# EAGLE design Shruthi-Analog-LP2Delay-v02 (EAGLE 5.09)
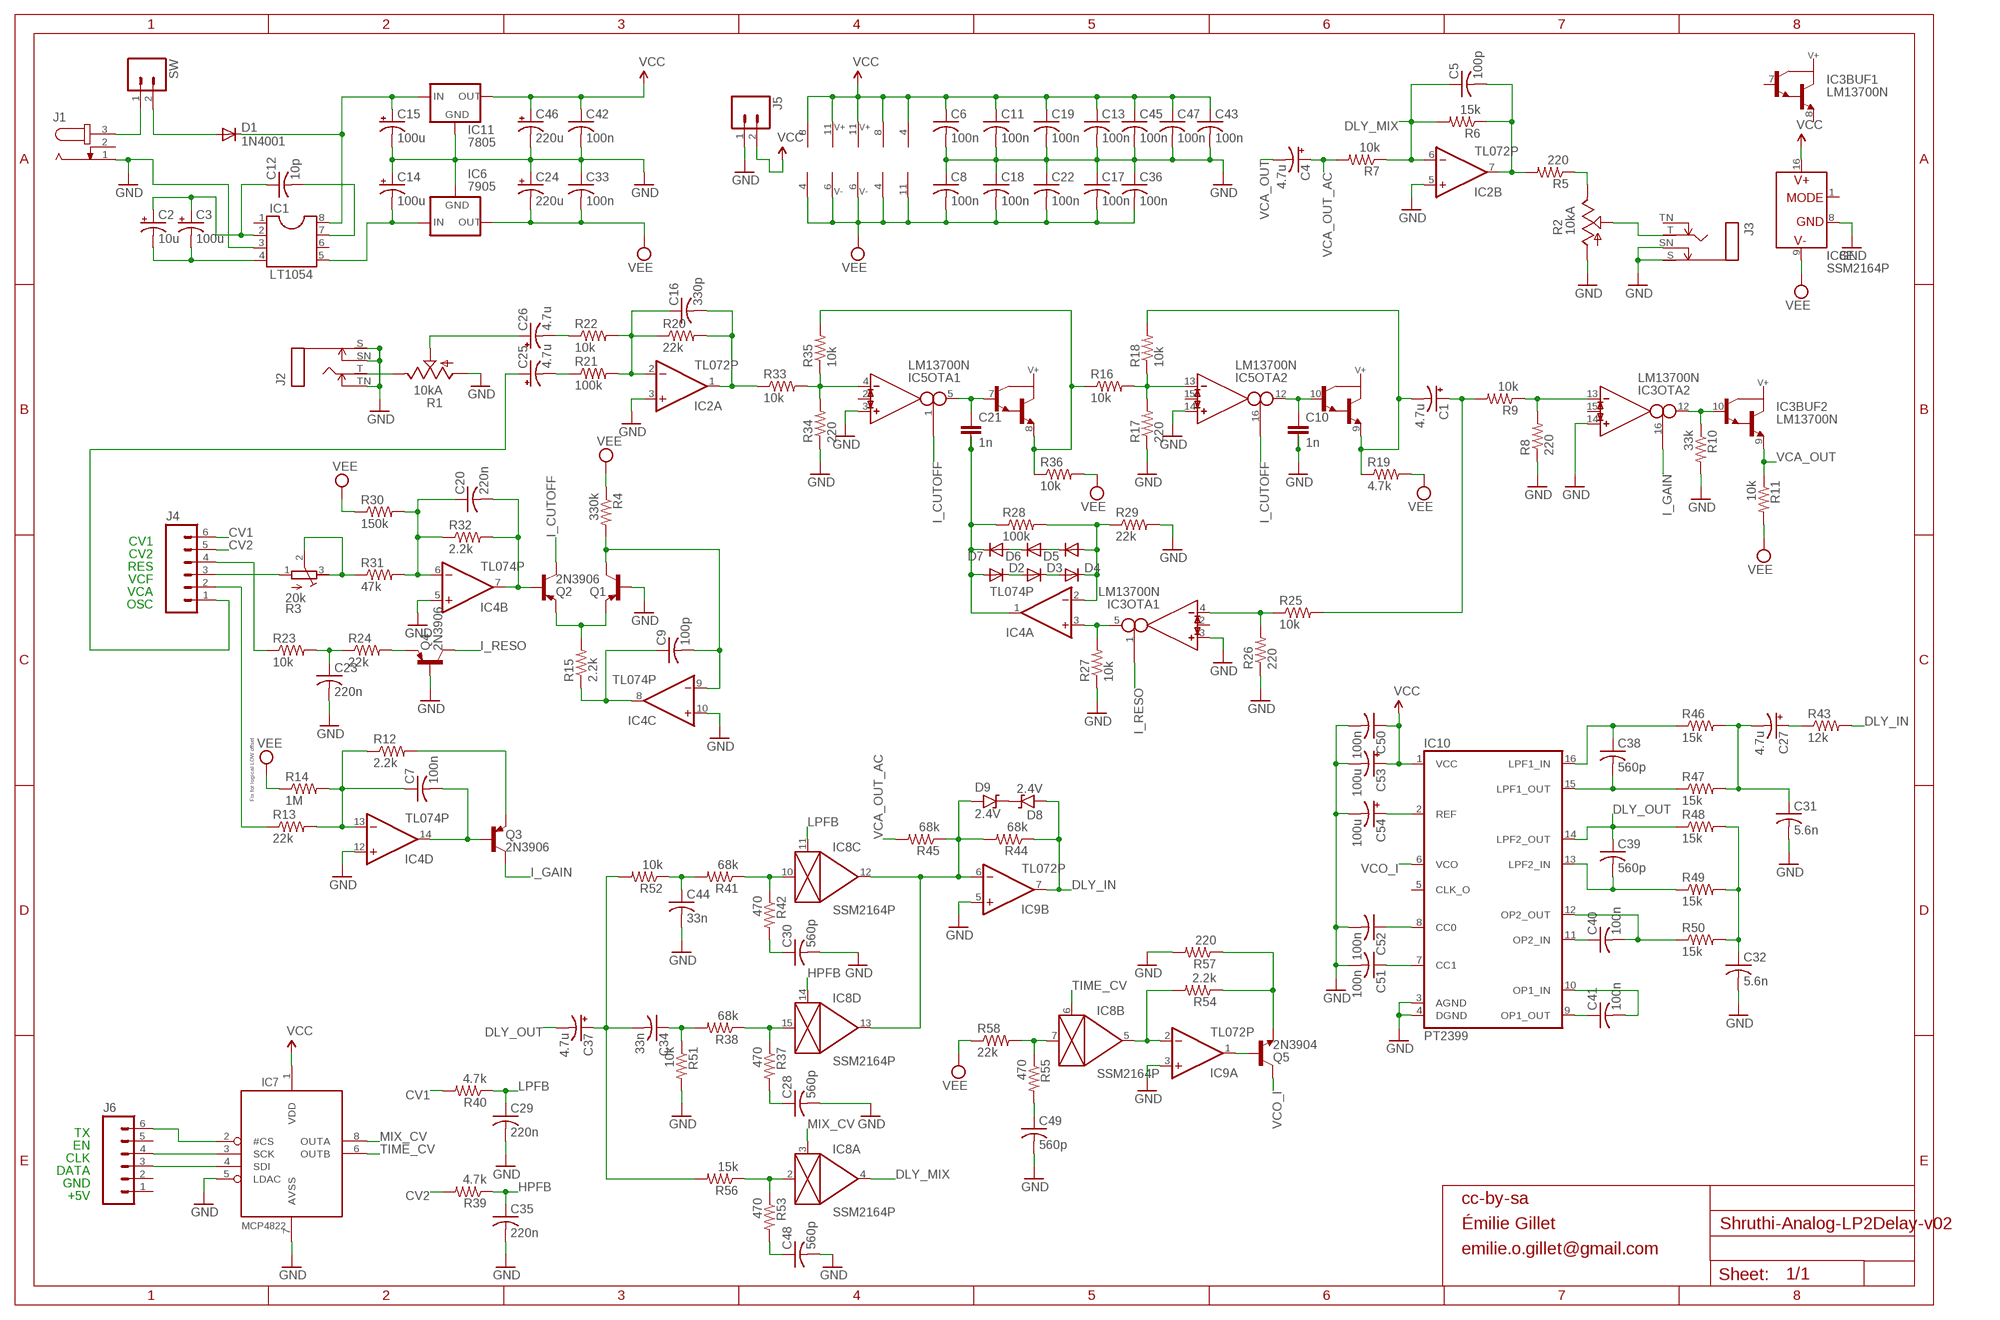
[diagram p0: schematic, sheet 1]

## Parts
C1  4.7u  CPOL-USE2.5-6  [E2,5-6]
C2  10u  CPOL-USE2.5-5  [E2,5-5]
C3  100u  CPOL-USE2.5-6  [E2,5-6]
C4  4.7u  CPOL-USE2.5-6  [E2,5-6]
C5  100p  C-US025-025X050  [C025-025X050]
C6  100n  C-US025-025X050  [C025-025X050]
C7  100n  C-US025-025X050  [C025-025X050]
C8  100n  C-US025-025X050  [C025-025X050]
C9  100p  C-US025-025X050  [C025-025X050]
C10  1n  C-2.5-5/2  [C2.5/5-2]
C11  100n  C-US025-025X050  [C025-025X050]
C12  10p  C-US025-025X050  [C025-025X050]
C13  100n  C-US025-025X050  [C025-025X050]
C14  100u  CPOL-USE2.5-7  [E2,5-7]
C15  100u  CPOL-USE2.5-7  [E2,5-7]
C16  330p  C-US025-025X050  [C025-025X050]
C17  100n  C-US025-025X050  [C025-025X050]
C18  100n  C-US025-025X050  [C025-025X050]
C19  100n  C-US025-025X050  [C025-025X050]
C20  220n  C-US025-025X050  [C025-025X050]
C21  1n  C-2.5-5/2  [C2.5/5-2]
C22  100n  C-US025-025X050  [C025-025X050]
C23  220n  C-US025-025X050  [C025-025X050]
C24  220u  CPOL-USE5-10.5  [E5-10,5]
C25  4.7u  CPOL-USE2.5-6  [E2,5-6]
C26  4.7u  CPOL-USE2.5-6  [E2,5-6]
C27  4.7u  CPOL-USE2.5-6  [E2,5-6]
C28  560p  C-US025-025X050  [C025-025X050]
C29  220n  C-US025-025X050  [C025-025X050]
C30  560p  C-US025-025X050  [C025-025X050]
C31  5.6n  C-US025-025X050  [C025-025X050]
C32  5.6n  C-US025-025X050  [C025-025X050]
C33  100n  C-US025-025X050  [C025-025X050]
C34  33n  C-US050-025X075  [C050-025X075]
C35  220n  C-US025-025X050  [C025-025X050]
C36  100n  C-US025-025X050  [C025-025X050]
C37  4.7u  CPOL-USE2.5-6  [E2,5-6]
C38  560p  C-US025-025X050  [C025-025X050]
C39  560p  C-US025-025X050  [C025-025X050]
C40  100n  C-US025-025X050  [C025-025X050]
C41  100n  C-US025-025X050  [C025-025X050]
C42  100n  C-US025-025X050  [C025-025X050]
C43  100n  C-US025-025X050  [C025-025X050]
C44  33n  C-US050-025X075  [C050-025X075]
C45  100n  C-US025-025X050  [C025-025X050]
C46  220u  CPOL-USE5-10.5  [E5-10,5]
C47  100n  C-US025-025X050  [C025-025X050]
C48  560p  C-US025-025X050  [C025-025X050]
C49  560p  C-US025-025X050  [C025-025X050]
C50  100n  C-US025-025X050  [C025-025X050]
C51  100n  C-US025-025X050  [C025-025X050]
C52  100n  C-US025-025X050  [C025-025X050]
C53  100u  CPOL-USE2.5-7  [E2,5-7]
C54  100u  CPOL-USE2.5-7  [E2,5-7]
D1  1N4001  1N4004  [DO41-10]
D2  DIODE-D-5  [D-5]
D3  DIODE-D-5  [D-5]
D4  DIODE-D-5  [D-5]
D5  DIODE-D-5  [D-5]
D6  DIODE-D-5  [D-5]
D7  DIODE-D-5  [D-5]
D8  2.4V  1N47XXDO35  [D-5]
D9  2.4V  1N47XXDO35  [D-5]
IC1  LT1054  DIL8  [DIL08]
IC2  TL072P  [DIL08]
IC3  LM13700N  [DIL16]
IC4  TL074P  TL084P  [DIL14]
IC5  LM13700N  [DIL16]
IC6  7905  79XXS  [79XXS]
IC7  MCP4822  [DIL08]
IC8  SSM2164P  [DIL16]
IC9  TL072P  [DIL08]
IC10  PT2399  [DIL16]
IC11  7805  78XXS  [78XXS]
J1  JACK-PLUG2  [SPC4078_BIG_HOLES]
J2  MONOSWS  [NMJ4HC-S]
J3  MONOSWS  [NMJ4HC-S]
J4  M06SIP  [1X06]
J5  M02PTH  [1X02]
J6  M06SIP  [1X06]
Q1  2N3906  2N3906-  [TO92-]
Q2  2N3906  2N3906-  [TO92-]
Q3  2N3906  2N3906-  [TO92-]
Q4  2N3906  2N3906-  [TO92-]
Q5  2N3904  [TO92-]
R1  10kA  POT_USCABLED  [CABLE_POT_6MM]
R2  10kA  POT_USCABLED  [CABLE_POT_6MM]
R3  20k  R-TRIMM3296X  [RTRIM3296X]
R4  330k  R-US_0204/7  [0204/7]
R5  220  R-US_0204/7  [0204/7]
R6  15k  R-US_0204/7  [0204/7]
R7  10k  R-US_0204/7  [0204/7]
R8  220  R-US_0204/7  [0204/7]
R9  10k  R-US_0204/7  [0204/7]
R10  33k  R-US_0204/7  [0204/7]
R11  10k  R-US_0204/7  [0204/7]
R12  2.2k  R-US_0204/7  [0204/7]
R13  22k  R-US_0204/7  [0204/7]
R14  1M  R-US_0204/7  [0204/7]
R15  2.2k  R-US_0204/7  [0204/7]
R16  10k  R-US_0204/7  [0204/7]
R17  220  R-US_0204/7  [0204/7]
R18  10k  R-US_0204/7  [0204/7]
R19  4.7k  R-US_0204/7  [0204/7]
R20  22k  R-US_0204/7  [0204/7]
R21  100k  R-US_0204/7  [0204/7]
R22  10k  R-US_0204/7  [0204/7]
R23  10k  R-US_0204/7  [0204/7]
R24  22k  R-US_0204/7  [0204/7]
R25  10k  R-US_0204/7  [0204/7]
R26  220  R-US_0204/7  [0204/7]
R27  10k  R-US_0204/7  [0204/7]
R28  100k  R-US_0204/7  [0204/7]
R29  22k  R-US_0204/7  [0204/7]
R30  150k  R-US_0204/7  [0204/7]
R31  47k  R-US_0204/7  [0204/7]
R32  2.2k  R-US_0204/7  [0204/7]
R33  10k  R-US_0204/7  [0204/7]
R34  220  R-US_0204/7  [0204/7]
R35  10k  R-US_0204/7  [0204/7]
R36  10k  R-US_0204/7  [0204/7]
R37  470  R-US_0204/7  [0204/7]
R38  68k  R-US_0204/7  [0204/7]
R39  4.7k  R-US_0204/7  [0204/7]
R40  4.7k  R-US_0204/7  [0204/7]
R41  68k  R-US_0204/7  [0204/7]
R42  470  R-US_0204/7  [0204/7]
R43  12k  R-US_0204/7  [0204/7]
R44  68k  R-US_0204/7  [0204/7]
R45  68k  R-US_0204/7  [0204/7]
R46  15k  R-US_0204/7  [0204/7]
R47  15k  R-US_0204/7  [0204/7]
R48  15k  R-US_0204/7  [0204/7]
R49  15k  R-US_0204/7  [0204/7]
R50  15k  R-US_0204/7  [0204/7]
R51  10k  R-US_0204/7  [0204/7]
R52  10k  R-US_0204/7  [0204/7]
R53  470  R-US_0204/7  [0204/7]
R54  2.2k  R-US_0204/7  [0204/7]
R55  470  R-US_0204/7  [0204/7]
R56  15k  R-US_0204/7  [0204/7]
R57  220  R-US_0204/7  [0204/7]
R58  22k  R-US_0204/7  [0204/7]
SW  M02PTH  [1X02]

## Nets
2P: C1.- IC5.9(BUF2:E) R18.2 R19.1
CAP_IN: D9.A IC8.12(C:OUT) IC8.13(D:OUT) IC9.6(B:-IN) R44.2 R45.1
CV1: J4.6 R40.2
CV2: J4.5 R39.2
DLY_IN: D8.A IC9.7(B:OUT) R43.2 R44.1
DLY_MIX: C5.1 IC2.6(B:-IN) IC8.4(A:OUT) R6.2 R7.1
DLY_OUT: C37.- C39.1 IC10.14(LPF2_OUT) R48.1
GND: C6.2 C8.1 C10.2 C10.3 C11.2 C13.2 C14.+ C15.- C17.1 C18.1 C19.2 C22.1 C23.2 C24.+ C28.2 C29.2 C30.2 C31.2 C32.2 C33.1 C35.2 C36.1 C42.2 C43.2 C44.2 C45.2 C46.- C47.2 C48.2 C49.2 C50.2 C51.2 C52.2 C53.- C54.- IC1.3 IC2.3(A:+IN) IC2.5(B:+IN) IC3.3(OTA1:IN_P) IC3.14(OTA2:IN_P) IC4.5(B:+IN) IC4.10(C:+IN) IC4.12(D:+IN) IC5.3(OTA1:IN_P) IC5.14(OTA2:IN_P) IC6.GND IC7.5(LDAC) IC7.7(AVSS) IC8.8(E:GND) IC9.3(A:+IN) IC9.5(B:+IN) IC10.3(AGND) IC10.4(DGND) IC11.GND J1.1 J2.S J2.SN J2.TN J3.S J3.SN J5.1 Q1.2(B) Q4.2(B) R1.A R2.A R8.1 R10.2 R17.1 R26.1 R27.1 R29.2 R34.1 R51.2 R57.2
HPFB: C35.1 IC8.14(D:CTRL) R39.1
I_CUTOFF: IC5.1(OTA1:I_BIAS) IC5.16(OTA2:I_BIAS) Q2.1(C)
I_GAIN: IC3.16(OTA2:I_BIAS) Q3.1(C)
I_RESO: IC3.1(OTA1:I_BIAS) Q4.1(C)
LPFB: C29.1 IC8.11(C:CTRL) R40.1
MIX: C16.2 IC2.1(A:OUT) R20.2 R33.1
MIX_CV: IC7.8(OUTA) IC8.3(A:CTRL)
N$1: IC3.5(OTA1:OUT) IC4.3(A:+IN) R27.2
N$2: C20.2 IC4.7(B:OUT) Q2.2(B) R32.2
N$3: R3.2(S) R3.3(A) R31.1
N$4: J4.3 R3.1(E)
N$5: C28.1 R37.2
N$6: C16.1 IC2.2(A:-IN) R20.1 R21.2 R22.2
N$7: Q1.3(E) Q2.3(E) R15.2
N$8: D4.C D5.A IC4.2(A:-IN) R28.2 R29.1
N$9: C9.1 IC4.8(C:OUT) R15.1
N$10: C9.2 IC4.9(C:-IN) Q1.1(C) R4.2
N$11: J4.4 R23.1
N$12: Q4.3(E) R24.2
N$13: J3.T R2.S
N$14: C23.1 R23.2 R24.1
N$16: IC5.13(OTA2:IN_N) R16.2 R17.2 R18.1
N$17: C30.1 R42.2
N$18: C1.+ R9.2 R25.2
N$19: IC5.8(BUF1:E) R16.1 R35.2 R36.1
N$20: C10.1 IC5.10(BUF2:B) IC5.12(OTA2:OUT)
N$21: IC8.10(C:IN) R41.1 R42.1
N$22: IC8.15(D:IN) R37.1 R38.1
N$23: IC5.4(OTA1:IN_N) R33.2 R34.2 R35.1
N$24: D5.C D6.A
N$25: R2.E R5.1
N$26: D6.C D7.A
N$27: C21.1 IC5.5(OTA1:OUT) IC5.7(BUF1:B)
N$28: D2.C D3.A
N$29: IC3.4(OTA1:IN_N) R25.1 R26.2
N$30: D3.C D4.A
N$31: C7.2 IC4.14(D:OUT) Q3.2(B)
N$32: C41.1 IC10.9(OP1_OUT)
N$33: IC3.10(BUF2:B) IC3.12(OTA2:OUT) R10.1
N$34: IC3.13(OTA2:IN_N) R8.2 R9.1
N$35: C25.+ J4.1
N$36: C51.1 IC10.7(CC1)
N$37: C52.1 IC10.8(CC0)
N$38: J2.T R1.E
N$39: C25.- R21.1
N$40: C20.1 IC4.6(B:-IN) R30.2 R31.2 R32.1
N$41: C27.+ R43.1
N$42: C54.+ IC10.2(REF)
N$43: C41.2 IC10.10(OP1_IN)
N$44: J1.3 SW.1
N$45: J4.2 R13.1
N$46: C15.+ D1.C IC1.8 IC11.IN
N$47: C2.+ C3.+ C12.1 IC1.2
N$48: C2.- C3.- IC1.4
N$49: C12.2 IC1.7
N$50: C40.1 IC10.11(OP2_IN)
N$51: C7.1 IC4.13(D:-IN) R12.1 R13.2 R14.2
N$55: C40.2 IC10.12(OP2_OUT) R50.1
N$56: D8.C D9.C
N$57: C38.2 IC10.15(LPF1_OUT) R47.1
N$58: C14.- IC1.5 IC6.IN
N$59: D1.A SW.2
N$60: C32.1 R48.2 R49.2 R50.2
N$61: C39.2 IC10.13(LPF2_IN) R49.1
N$62: C38.1 IC10.16(LPF1_IN) R46.1
N$63: C5.2 IC2.7(B:OUT) R5.2 R6.1
N$64: C27.- C31.1 R46.2 R47.2
N$65: C21.2 C21.3 D2.A D7.C IC4.1(A:OUT) R28.1
N$66: C26.+ R1.S
N$68: Q3.3(E) R12.2
N$70: IC9.1(A:OUT) Q5.2(B)
N$71: C48.1 R53.2
N$72: C26.- R22.1
N$73: IC8.2(A:IN) R53.1 R56.1
N$74: C34.1 R38.2 R51.1
N$75: C44.1 R41.2 R52.1
N$76: C34.2 C37.+ R52.2 R56.2
N$77: IC8.5(B:OUT) IC9.2(A:-IN) R54.2
N$78: Q5.3(E) R54.1 R57.1
N$80: IC7.2(#CS) J6.6
N$81: IC7.3(SCK) J6.4
N$82: IC7.4(SDI) J6.3
N$83: C49.1 R55.2
N$84: IC8.7(B:IN) R55.1 R58.2
TIME_CV: IC7.6(OUTB) IC8.6(B:CTRL)
VCA_OUT: C4.- IC3.9(BUF2:E) R11.1
VCA_OUT_AC: C4.+ R7.2 R45.2
VCC: C6.1 C11.1 C13.1 C19.1 C42.1 C43.1 C45.1 C46.+ C47.1 C50.1 C53.+ IC2.8(P:V+) IC3.11(SUPPLY:V+) IC4.4(P:V+) IC5.11(SUPPLY:V+) IC7.1(VDD) IC8.16(E:V+) IC9.8(P:V+) IC10.1(VCC) IC11.OUT J5.2
VCO_I: IC10.6(VCO) Q5.1(C)
VEE: C8.2 C17.2 C18.2 C22.2 C24.- C33.2 C36.2 IC2.4(P:V-) IC3.6(SUPPLY:V-) IC4.11(P:V-) IC5.6(SUPPLY:V-) IC6.OUT IC8.9(E:V-) IC9.4(P:V-) R4.1 R11.2 R14.1 R19.2 R30.1 R36.2 R58.1
Unconnected: IC1.1 IC1.6 IC3.2(OTA1:I_DIODE) IC3.7(BUF1:B) IC3.8(BUF1:E) IC3.15(OTA2:I_DIODE) IC5.2(OTA1:I_DIODE) IC5.15(OTA2:I_DIODE) IC8.1(E:MODE) IC10.5(CLK_O) J1.2 J3.TN J6.1 J6.2 J6.5

## Notes on the sheet
- CV1
- CV2
- RES
- VCF
- VCA
- OSC
- Fix for logical LOW offset
- TX
- EN
- CLK
- DATA
- GND
- +5V
- cc-by-sa
- Émilie Gillet
- emilie.o.gillet@gmail.com

## Library data of the parts
C1-C4 C14 C15 C24-C27 C37 C46 C53 C54 = rcl:CPOL-US: POLARIZED CAPACITOR, American symbol
C5-C9 C11-C13 C16-C20 C22 C23 C28-C36 C38-C45 C47-C52 = rcl:C-US: CAPACITOR, American symbol
C10 C21 = capacitor-wima:C-: CAPACITOR for alternative placement naming: default grid - extended grid/package width
D1 = diode:1N4004: DIODE general purpose rectifier, 1 A
D2-D7 = diode:DIODE-: DIODE
D8 D9 = og-diodes:1N47XX: Zener Diode 1N4728 - 1N4764: 3.3 V - 100V, 10% (1n47xxA 5%); DO-41 glass case
IC1 = ic-package:DIL8: Dual In Line / Socket
IC2 IC9 = og-linear:TL072: OP AMP
IC3 IC5 = ota:LM13700: Dual OTA with buffers
IC4 = linear:TL084: OP AMP
IC6 = v-reg:79XXS: VOLTAGE REGULATOR
IC7 = og-dac:MCP4822
IC8 = ssm2164:SSM2164
IC10 = og-ics:PT2399
IC11 = v-reg:78XXS: VOLTAGE REGULATOR
J1 = con-jack2:JACK-PLUG: DC POWER JACK Power Jack, DC, Right Angle, Through Hole, Rated 5A at 16VDC, PC Terminals Distributor: Farnell (www.Farnell.de) Drawing: 84N1161.pdf / 84N1162.pdf Manufacturer: SPC Technology (www.spctechnology.com) Type: SPC4077 / SPC 4078
J2 J3 = og-neutrik:MONOSW
J4 J6 = SparkFun:M06: Header 6 Standard 6-pin 0.1" header. Use with straight break away headers (SKU : PRT-00116), right angle break away headers (PRT-00553), swiss pins (PRT-00743), machine pins (PRT-00117), and female headers (PRT-00115). Molex polarized connector foot print use with SKU : PRT-08094 with associated crimp pins and housings. NOTES ON THE VARIANTS LOCK and LOCK_LONGPADS... This footprint was designed to help hold the alignment of a through-hole component (i.e. 6-pin header) while soldering it into place. You may notice that each hole has been shifted either up or down by 0.005 of an inch from it's more standard position (which is a perfectly straight line). This slight alteration caused the pins (the squares in the middle) to touch the edges of the holes. Because they are alternating, it causes a "brace" to hold the component in place. 0.005 has proven to be the perfect amount of "off-center" position when using our standard breakaway headers. Although looks a little odd when you look at the bare footprint, once you have a header in there, the alteration is very hard to notice. Also, if you push a header all the way into place, it is covered up entirely on the bottom side. This idea of altering the position of holes to aid alignment will be further integrated into the Sparkfun Library for other footprints. It can help hold any component with 3 or more connection pins.
J5 SW = SparkFun:M02: Header 2 Standard 2-pin 0.1" header. Use with straight break away headers (SKU : PRT-00116), right angle break away headers (PRT-00553), swiss pins (PRT-00743), machine pins (PRT-00117), and female headers (PRT-00115). Molex polarized connector foot print use with SKU : PRT-08233 with associated crimp pins and housings.
Q1-Q4 = gm-trans:2N3906: PNP Transistor
Q5 = gm-trans:2N3904: NPN Transistor
R1 R2 = pot-alps:POT_US
R3 = rcl:R-TRIMM: Trimm resistor
R4-R58 = rcl:R-US_: RESISTOR, American symbol

## Board
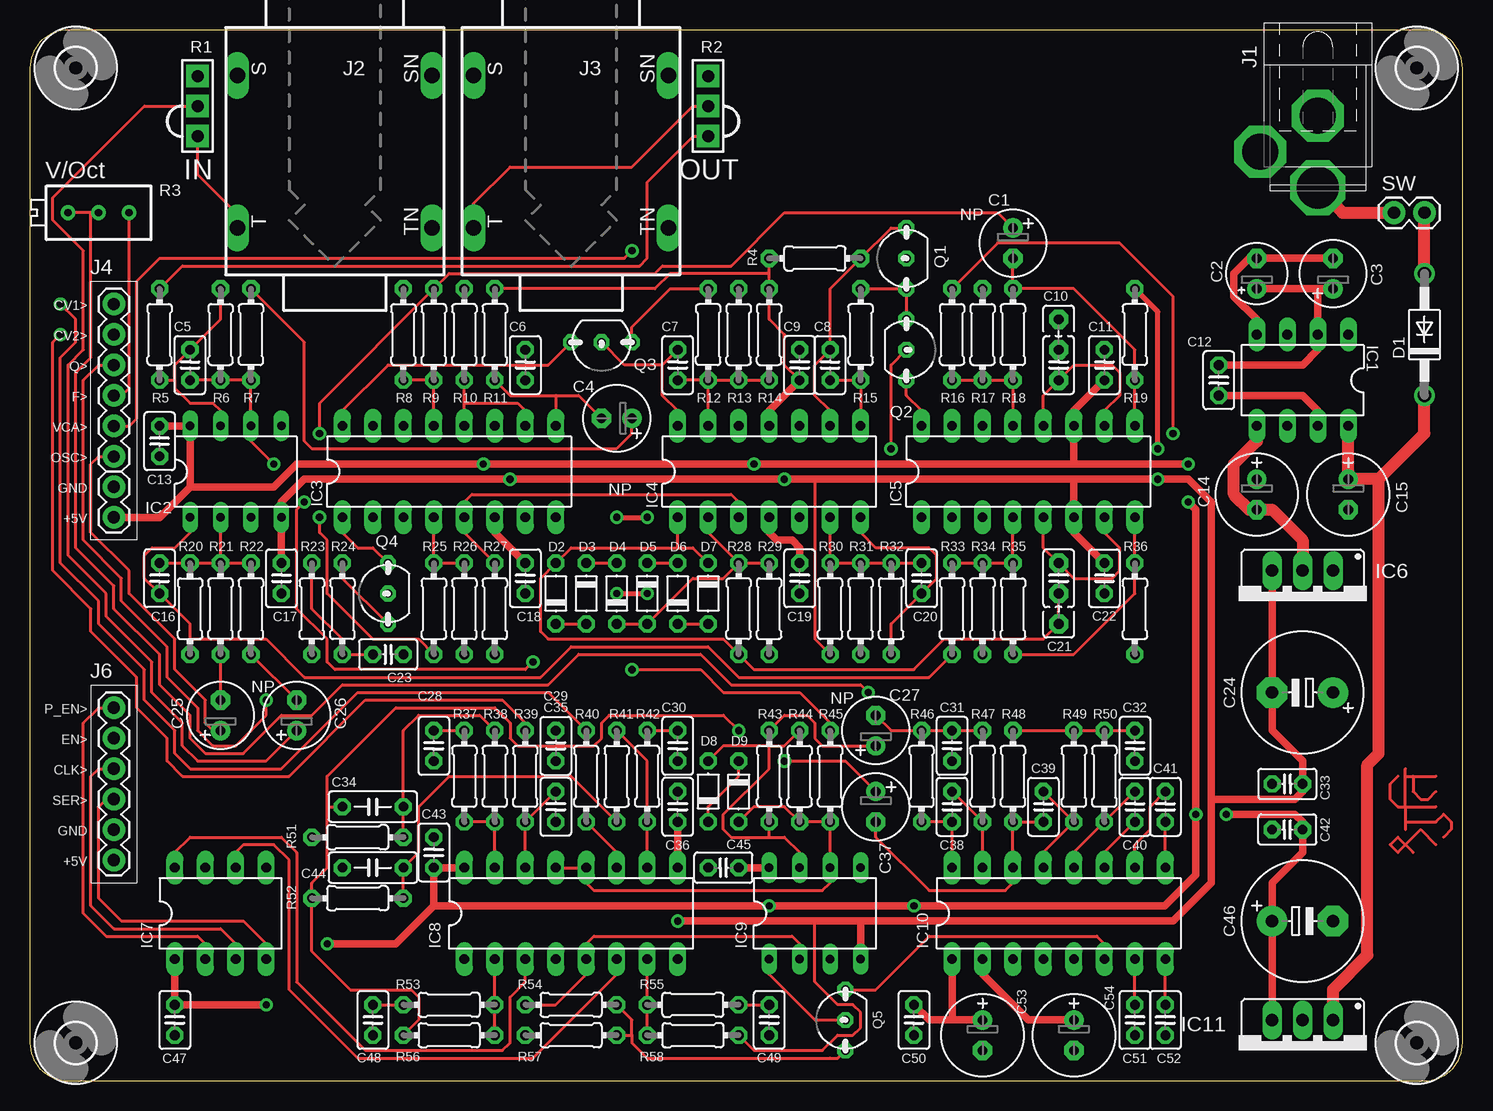
[diagram p1: board, top side]
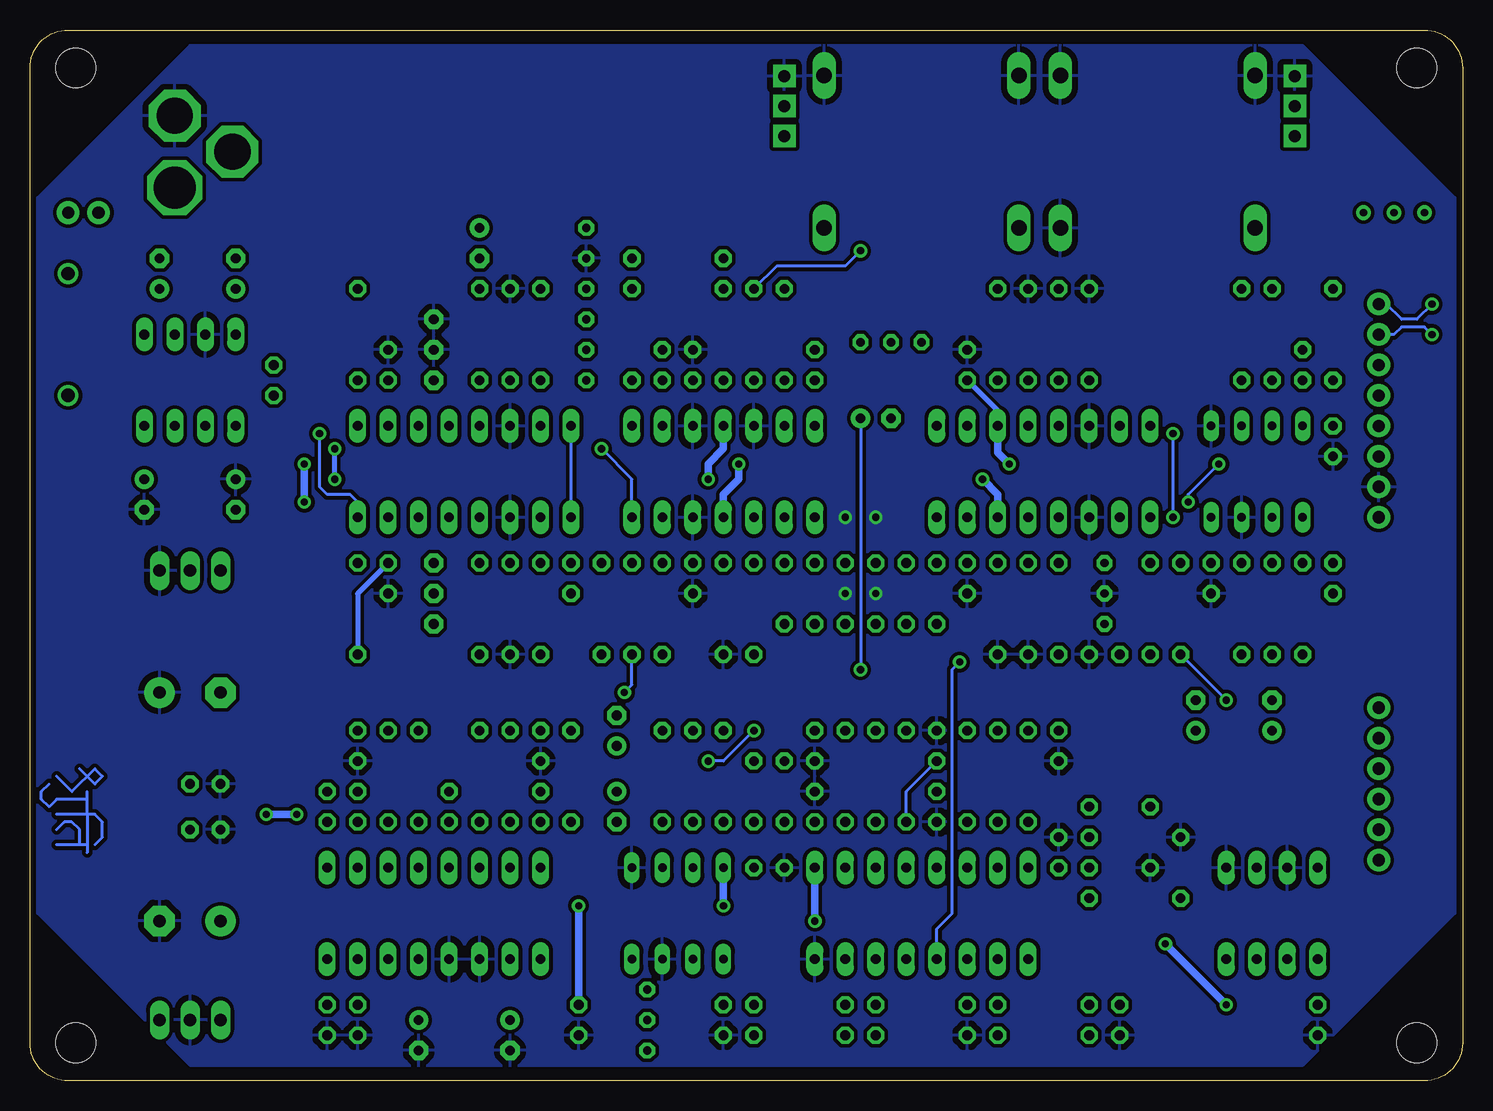
[diagram p2: board, bottom side, seen from below]

Size 119.38 x 87.62 mm. Coordinates in mm from the lower left corner, seen from the top.
Outline: 119.38,84.45 arc90 116.2,87.62 3.18,87.62 arc90 0,84.45 0,3.17 arc90 3.18,0 116.2,0 arc90 119.38,3.17 119.38,84.45
Copper layers (1*16): Top 0.035mm / dielectric 1.5mm / Bottom 0.035mm
Design rules "SparkFun *": minimum track width 8mil, minimum drill 20mil, track to track 8mil, track to pad 8mil, pad to pad 8mil, via to via 8mil, smd to smd 8mil, copper to edge 10mil, drill to drill 8mil, minimum pad ring 12mil, minimum via ring 10mil, stop-mask expansion 4mil, vias tented up to drill 25mil, thermal gap 20mil

### Footprints (pad centres in the part's own frame; a part is rotated, then mirrored left to right if it is on the bottom)
E2,5-6 = drill 0.813 pad 1.6 round: + -1.27,0 | drill 0.813 pad 1.6 octagon: - 1.27,0
E2,5-5 = drill 0.813 pad 1.6 round: + -1.27,0 | drill 0.813 pad 1.6 octagon: - 1.27,0
C025-025X050 = drill 0.813 octagon: 1 -1.27,0; 2 1.27,0
C2.5/5-2 = drill 0.813 pad 1.6 octagon: 1 -1.27,0; 2 1.27,0; 3 3.81,0
E2,5-7 = drill 0.813 pad 1.6 round: + -1.27,0 | drill 0.813 pad 1.6 octagon: - 1.27,0
E5-10,5 = drill 1.016 pad 2.54 round: + -2.54,0 | drill 1.016 pad 2.54 octagon: - 2.54,0
C050-025X075 = drill 0.813 octagon: 1 -2.54,0; 2 2.54,0
DO41-10 = drill 1.118 round: A 5.08,0; C -5.08,0
D-5 = drill 0.813 octagon: A 2.54,0; C -2.54,0
DIL08 = drill 0.813 long: 1 -3.81,-3.81; 2 -1.27,-3.81; 3 1.27,-3.81; 4 3.81,-3.81; 5 3.81,3.81; 6 1.27,3.81; 7 -1.27,3.81; 8 -3.81,3.81
DIL08' = drill 0.7 long: 1 -3.81,-3.81; 2 -1.27,-3.81; 3 1.27,-3.81; 4 3.81,-3.81; 5 3.81,3.81; 6 1.27,3.81; 7 -1.27,3.81; 8 -3.81,3.81
DIL16 = drill 0.813 long: 1 -8.89,-3.81; 2 -6.35,-3.81; 3 -3.81,-3.81; 4 -1.27,-3.81; 5 1.27,-3.81; 6 3.81,-3.81; 7 6.35,-3.81; 8 8.89,-3.81; 9 8.89,3.81; 10 6.35,3.81; 11 3.81,3.81; 12 1.27,3.81; 13 -1.27,3.81; 14 -3.81,3.81; 15 -6.35,3.81; 16 -8.89,3.81
DIL14 = drill 0.813 long: 1 -7.62,-3.81; 2 -5.08,-3.81; 3 -2.54,-3.81; 4 0,-3.81; 5 2.54,-3.81; 6 5.08,-3.81; 7 7.62,-3.81; 8 7.62,3.81; 9 5.08,3.81; 10 2.54,3.81; 11 0,3.81; 12 -2.54,3.81; 13 -5.08,3.81; 14 -7.62,3.81
79XXS = drill 1.016 long: GND -2.54,-2.54; IN 0,-2.54; OUT 2.54,-2.54
78XXS = drill 1.016 long: GND 0,-2.54; IN -2.54,-2.54; OUT 2.54,-2.54
SPC4078_BIG_HOLES = drill 3.023 pad 4.318 octagon: 1 -0.46,0; 2 2.54,-4.8 | drill 3.531 pad 4.572 octagon: 3 5.54,0
NMJ4HC-S = drill 1.3 long: S 5.08,8.115; SN 5.08,-8.115; T -7.62,8.115; TN -7.62,-8.115
1X06 = drill 1.016 pad 1.88 round: 1 0,0; 2 2.54,0; 3 5.08,0; 4 7.62,0; 5 10.16,0; 6 12.7,0
1X02 = drill 1.016 pad 1.88 round: 1 0,0; 2 2.54,0
TO92- = drill 0.7 octagon: 1 2.54,0; 2 0,0; 3 -2.54,0
CABLE_POT_6MM = drill 1 pad 1.88 square: A -2.5,0; E 2.5,0; S 0,0
RTRIM3296X = drill 0.61 round: 1 0,-2.54; 2 0,0; 3 0,2.54
0204/7 = drill 0.813 octagon: 1 -3.81,0; 2 3.81,0
3,3 = hole 3.3: 0,0

### Placement (x,y rotation side)
C1  81.92,69.85 270 top
C2  102.23,67.31 90 top
C3  108.58,67.31 90 top
C4  48.89,55.25 180 top
C5  13.34,59.69 90 top
C6  41.27,59.69 90 top
C7  53.98,59.69 90 top
C8  64.14,59.69 270 top
C9  66.67,59.69 90 top
C10  85.72,59.69 90 top
C11  89.53,59.69 90 top
C12  99.06,58.42 270 top
C13  10.79,53.34 270 top
C14  102.23,48.9 270 top
C15  109.86,48.9 270 top
C16  10.79,41.91 270 top
C17  20.96,41.91 90 top
C18  41.27,41.91 90 top
C19  64.14,41.91 270 top
C20  74.3,41.91 270 top
C21  85.72,41.91 270 top
C22  89.53,41.91 90 top
C23  29.84,35.56 0 top
C24  106.05,32.38 180 top
C25  15.88,30.48 90 top
C26  22.23,30.48 90 top
C27  70.48,29.21 90 top
C28  33.66,27.94 270 top
C29  43.81,27.94 90 top
C30  53.98,27.94 270 top
C31  76.83,27.94 270 top
C32  92.08,27.94 270 top
C33  104.78,24.76 0 top
C34  28.57,22.86 180 top
C35  43.81,22.86 270 top
C36  53.98,22.86 270 top
C37  70.48,22.86 270 top
C38  76.83,22.86 90 top
C39  84.45,22.86 90 top
C40  92.08,22.86 90 top
C41  94.61,22.86 90 top
C42  104.78,20.95 180 top
C43  33.66,19.05 90 top
C44  28.57,17.78 180 top
C45  57.78,17.78 180 top
C46  106.05,13.34 0 top
C47  12.07,5.08 270 top
C48  28.57,5.08 270 top
C49  61.59,5.08 270 top
C50  73.66,5.08 270 top
C51  92.08,5.08 270 top
C52  94.61,5.08 270 top
C53  79.38,3.81 270 top
C54  87,3.81 270 top
D1  116.2,62.23 90 top
D2  43.81,40.64 90 top
D3  46.35,40.64 270 top
D4  48.89,40.64 90 top
D5  51.44,40.64 270 top
D6  53.98,40.64 90 top
D7  56.52,40.64 270 top
D8  56.52,24.13 90 top
D9  59.05,24.13 270 top
IC1  106.05,58.42 180 top
IC2  TL072P  [DIL08']  17.14,50.8 0 top
IC3  34.93,50.8 0 top
IC4  61.59,50.8 0 top
IC5  83.19,50.8 0 top
IC6  106.05,40.01 180 top
IC7  15.88,13.97 0 top
IC8  45.09,13.97 0 top
IC9  TL072P  [DIL08']  65.41,13.97 0 top
IC10  85.72,13.97 0 top
IC11  106.05,2.54 180 top
J1  107.31,80.01 270 top
J2  25.4,78.74 90 top
J3  45.09,78.74 90 top
J4  6.99,52.07 90 top
J5  6.99,49.53 270 top
J6  6.99,18.41 90 top
Q1  73.03,68.58 90 top
Q2  73.03,60.96 270 top
Q3  47.62,61.59 180 top
Q4  29.84,40.64 90 top
Q5  67.95,5.08 90 top
R1  13.97,81.28 270 top
R2  56.52,81.28 270 top
R3  5.71,72.39 90 top
R4  65.41,68.58 0 top
R5  10.79,62.23 270 top
R6  15.88,62.23 270 top
R7  18.41,62.23 90 top
R8  31.11,62.23 270 top
R9  33.66,62.23 90 top
R10  36.2,62.23 90 top
R11  38.73,62.23 90 top
R12  56.52,62.23 90 top
R13  59.05,62.23 270 top
R14  61.59,62.23 270 top
R15  69.22,62.23 90 top
R16  76.83,62.23 270 top
R17  79.38,62.23 270 top
R18  81.92,62.23 90 top
R19  92.08,62.23 90 top
R20  13.34,39.37 270 top
R21  15.88,39.37 90 top
R22  18.41,39.37 90 top
R23  23.5,39.37 90 top
R24  26.04,39.37 90 top
R25  33.66,39.37 270 top
R26  36.2,39.37 90 top
R27  38.73,39.37 90 top
R28  59.05,39.37 90 top
R29  61.59,39.37 270 top
R30  66.67,39.37 90 top
R31  69.22,39.37 90 top
R32  71.75,39.37 270 top
R33  76.83,39.37 90 top
R34  79.38,39.37 90 top
R35  81.92,39.37 270 top
R36  92.08,39.37 270 top
R37  36.2,25.4 90 top
R38  38.73,25.4 90 top
R39  41.27,25.4 90 top
R40  46.35,25.4 90 top
R41  48.89,25.4 270 top
R42  51.44,25.4 90 top
R43  61.59,25.4 270 top
R44  64.14,25.4 270 top
R45  66.67,25.4 90 top
R46  74.3,25.4 90 top
R47  79.38,25.4 90 top
R48  81.92,25.4 90 top
R49  87,25.4 90 top
R50  89.53,25.4 90 top
R51  27.3,20.32 180 top
R52  27.3,15.24 180 top
R53  34.93,6.35 180 top
R54  45.09,6.35 180 top
R55  55.24,6.35 0 top
R56  34.93,3.81 180 top
R57  45.09,3.81 180 top
R58  55.24,3.81 180 top
SW  113.67,72.39 0 top
U$1  [3,3]  3.81,84.45 0 top
U$2  [3,3]  115.57,84.45 0 top
U$3  [3,3]  3.81,3.17 0 top
U$4  [3,3]  115.57,3.17 0 top
U$5  [MUTABLE_PROF]  61.91,69.22 0 top

### Tracks (layer width: path | path; a pad name or v marks a point on that pad's centre or on a via)
2P
  Top 0.254: IC5.9 R19.1 92.08,60.96 87,66.04 R18.2 C1.-
CAP_IN
  Top 0.254: IC8.13 IC8.12 46.35,16.51 46.99,15.88 66.04,15.88 66.67,16.51 IC9.6 R45.1 R44.2 62.87,22.86 60.33,22.86 D9.A
CV1  (via drill 0.6)
  Top 0.254: v2.54,64.77 3.81,63.5 3.81,61.59 2.54,60.33 2.54,43.18 5.71,40.01 5.71,38.1 9.53,34.29 9.53,31.75 12.07,29.21 12.07,27.3 13.34,26.04 20.96,26.04 27.3,32.38 43.18,32.38 R40.2
  Bottom 0.254: v2.54,64.77 3.81,63.5 5.08,63.5 6.35,64.77 J4.6
CV2  (via drill 0.6)
  Top 0.254: v2.54,62.23 1.91,61.59 1.91,42.55 5.08,39.37 5.08,37.47 8.89,33.66 8.89,31.11 11.43,28.57 11.43,26.67 12.7,25.4 21.59,25.4 27.94,31.75 39.37,31.75 41.27,29.84 R39.2
  Bottom 0.254: v2.54,62.23 3.18,62.87 5.08,62.87 5.71,62.23 J4.5
DLY_IN
  Top 0.254: 61.59,20.32 R43.2 | 61.59,20.32 58.42,20.32 57.78,20.95 57.78,22.22 61.59,26.04 61.59,27.94 | 61.59,27.94 62.87,27.94 R44.1 | D8.A 57.78,27.94 61.59,27.94 | IC9.7 64.14,19.05 62.87,20.32 61.59,20.32
DLY_MIX  (via drill 0.6)
  Top 0.254: v22.86,48.26 22.23,47.62 22.23,39.37 24.77,36.83 24.77,34.92 25.4,34.29 41.27,34.29 v41.91,34.92 | v20.32,51.44 18.41,53.34 IC2.6 R7.1 R6.2 C5.1
  Bottom 0.254: IC8.4 43.81,12.7 42.55,13.97 42.55,34.29 v41.91,34.92 | v20.32,51.44 22.86,48.9 v22.86,48.26
DLY_OUT
  Top 0.254: C39.1 R48.1 81.92,18.41 IC10.14 81.92,16.51 81.28,15.88 74.93,15.88 70.48,20.32 C37.-
GND  (via drill 0.6)
  Top 0.406: v48.89,40.64 v51.44,40.64 | v48.89,46.99 v51.44,46.99
  pour Bottom (isolate 0.305): 118.75,73.66 106.05,86.36 13.34,86.36 0.64,73.66 0.64,13.97 13.34,1.27 106.05,1.27 118.75,13.97
HPFB
  Top 0.254: C35.1 R39.1 41.27,18.41 IC8.14
I_CUTOFF
  Top 0.254: IC5.16 74.3,55.88 73.03,57.15 Q2.1
  Bottom 0.254: IC5.1 IC5.16
I_GAIN
  Top 0.254: IC3.16 26.04,55.88 29.84,59.69 43.18,59.69 Q3.1
I_RESO
  Top 0.254: IC3.1 26.04,45.72 27.3,44.45 28.57,44.45 Q4.1
LPFB
  Top 0.254: IC8.11 48.89,19.05 R40.1
  Bottom 0.254: C29.1 46.35,24.13 R40.1
MIX
  Top 0.254: IC2.1 13.34,45.72 12.07,44.45 10.16,44.45 9.53,43.82 9.53,41.91 C16.2 13.34,38.1 13.34,36.83 | R20.2 13.34,36.83 | R33.1 74.93,33.66 59.05,33.66 56.52,36.2 45.09,36.2 42.55,33.66 22.86,33.66 19.68,36.83 13.34,36.83
MIX_CV
  Top 0.254: IC7.8 12.07,19.05 13.34,20.32 20.96,20.32 22.23,19.05 22.23,8.26 27.94,2.54 39.37,2.54 40.01,3.17 40.01,6.98 41.27,8.26 IC8.3
N$1
  Top 0.254: IC4.3 59.05,48.26 58.42,48.9 36.83,48.9 36.2,48.26 IC3.5 36.2,45.72 R27.2
N$2  (via drill 0.6)
  Top 0.254: Q2.2 71.75,59.69 v71.75,52.71 | IC4.7 69.22,45.72 70.48,44.45 74.93,44.45 75.56,43.82 75.56,41.91 C20.2 71.75,38.1 R32.2
  Bottom 0.254: v71.75,52.71 69.22,50.16 IC4.7
N$3  (via drill 0.6)
  Top 0.254: 5.08,72.39 R3.3 | 5.08,72.39 R3.2 | 5.08,72.39 5.08,60.33 3.81,59.05 3.81,44.45 6.99,41.28 6.99,39.37 10.79,35.56 10.79,33.02 13.34,30.48 13.34,28.57 14.61,27.3 17.78,27.3 20.96,30.48 23.5,30.48 26.04,33.02 43.18,33.02 45.72,35.56 55.88,35.56 58.42,33.02 69.22,33.02 v69.85,32.38
  Bottom 0.254: v69.85,32.38 69.22,33.02 R31.1
N$4
  Top 0.254: J4.3 7.62,57.15 8.26,57.79 R3.1
N$5
  Top 0.254: C28.1 R37.2
N$6
  Top 0.254: R21.2 IC2.2 | C16.1 R20.1 R21.2 | R21.2 R22.2
N$7
  Top 0.254: R15.2 Q1.3 Q2.3
N$8
  Top 0.254: R28.2 R29.1 | IC4.2 56.52,45.72 R28.2 | D4.C D5.A 55.24,41.91 57.78,41.91 R28.2
N$9
  Top 0.254: IC4.8 R15.1 C9.1
N$10
  Top 0.254: Q1.1 71.75,71.12 R4.2 66.67,66.04 C9.2 65.41,59.69 65.41,57.15 66.67,55.88 IC4.9
N$11  (via drill 0.6)
  Top 0.254: J4.4 5.71,59.69 4.45,58.42 4.45,45.09 7.62,41.91 7.62,40.01 11.43,36.2 11.43,33.66 13.97,31.11 13.97,29.21 15.24,27.94 17.14,27.94 19.68,30.48 v19.68,31.75
  Bottom 0.254: v19.68,31.75 R23.1
N$12
  Top 0.254: Q4.3 26.04,41.91 R24.2
N$13
  Top 0.254: J3.T 36.97,73.17 40.01,76.2 50.16,76.2 55.24,81.28 R2.S
N$14
  Top 0.254: R23.2 23.5,39.37 26.04,36.83 R24.1 C23.1
N$15
  Bottom 0.254: 117.16,25.4 115.89,24.13 113.98,26.04 113.35,25.4 113.98,24.76 115.25,26.04
N$16
  Top 0.254: R16.2 R17.2 R18.1 IC5.13
N$17
  Top 0.254: R42.2 C30.1
N$18  (via drill 0.6)
  Top 0.254: v24.13,46.99 24.13,45.72 24.77,45.09 24.77,40.64 28.57,36.83 32.38,36.83 R25.2 | v24.13,53.98 24.13,56.52 R9.2 34.93,67.31 52.07,67.31 52.7,67.95 58.42,67.95 62.87,72.39 80.64,72.39 C1.+
  Bottom 0.254: v24.13,46.99 v24.13,53.98
N$19  (via drill 0.6)
  Top 0.254: IC5.8 R36.1 92.08,40.64 87,35.56 R35.2 | R16.1 80.64,69.85 90.8,69.85 95.25,65.41 v95.25,53.98
  Bottom 0.254: v95.25,53.98 95.25,49.53 94.61,48.9 92.71,48.9 92.08,48.26 IC5.8
N$20
  Top 0.254: IC5.12 84.45,57.15 C10.1 87,59.69 90.17,59.69 90.8,59.05 90.8,57.15 89.53,55.88 IC5.10
N$21
  Top 0.254: IC8.10 R42.1 51.44,26.67 R41.1
N$22
  Top 0.254: IC8.15 R38.1 R37.1
N$23
  Top 0.254: R33.2 R34.2 R35.1 IC5.4
N$24
  Top 0.254: D5.C D6.A
N$25
  Top 0.254: R2.E 55.28,78.78 51.44,74.93 51.44,68.58 50.8,67.95 12.7,67.95 R5.1
N$26
  Top 0.254: D6.C D7.A
N$27
  Top 0.254: IC5.5 84.45,44.45 C21.1 87,41.91 90.17,41.91 90.8,42.55 90.8,44.45 89.53,45.72 IC5.7
N$28
  Top 0.254: D2.C D3.A
N$29
  Top 0.254: R26.2 R25.1 IC3.4
N$30
  Top 0.254: D3.C D4.A
N$31
  Top 0.254: IC4.14 53.98,55.88 52.7,57.15 52.7,59.69 | Q3.2 49.53,59.69 52.7,59.69 | 52.7,59.69 C7.2
N$32
  Top 0.254: IC10.9 C41.1
N$33
  Top 0.254: IC3.12 36.2,56.52 | 36.2,56.52 R10.1 | IC3.10 41.27,55.88 40.64,56.52 36.2,56.52
N$34
  Top 0.254: IC3.13 R9.1 R8.2
N$35
  Top 0.254: C25.+ 15.24,29.21 14.61,29.84 14.61,31.75 12.07,34.29 12.07,36.83 8.26,40.64 8.26,42.55 5.08,45.72 5.08,51.44 5.71,52.07 J4.1
N$36
  Top 0.254: C51.1 IC10.7
N$37
  Top 0.254: C52.1 IC10.8
N$38
  Top 0.254: J2.T 17.14,71.26 17.14,72.39 13.97,75.56 R1.E
N$39
  Top 0.254: C25.- R21.1
N$40
  Top 0.254: IC4.6 R30.2 R31.2 R32.1 C20.1
N$41
  Top 0.254: R43.1 62.87,30.48 64.77,30.48 65.41,29.84 65.41,28.57 66.04,27.94 C27.+
N$42
  Top 0.61: IC10.2 79.38,8.89 83.19,5.08 C54.+
N$43
  Top 0.254: C41.2 93.34,22.86 93.34,20.95 92.08,19.68 IC10.10
N$44
  Top 1.016: J1.3 109.39,72.39 SW.1
N$45  (via drill 0.6)
  Top 0.254: J4.2 8.26,54.61 8.89,55.25 8.89,66.67 10.79,68.58 49.53,68.58 v50.16,69.22
  Bottom 0.254: v50.16,69.22 51.44,67.95 57.15,67.95 R13.1
N$46
  Top 1.016: 112.39,50.16 116.2,53.98 D1.C | 112.39,50.16 C15.+ IC1.8 | IC11.IN 108.58,7.62 111.44,10.48 111.44,26.35 112.39,27.3 112.39,50.16
N$47
  Top 0.61: C12.1 106.05,59.69 107.31,60.96 IC1.2 107.31,66.04 | 107.31,66.04 C3.+ | 107.31,66.04 C2.+
N$48
  Top 0.61: IC1.4 102.23,63.5 100.33,65.41 100.33,67.31 101.6,68.58 C2.- C3.-
N$49
  Top 0.61: IC1.7 107.31,55.88 106.05,57.15 C12.2
N$50
  Top 0.254: IC10.11 89.53,19.05 C40.1
N$51
  Top 0.254: IC4.13 R12.1 | R12.1 C7.1 | R12.1 R13.2 R14.2
N$52
  Bottom 0.254: 114.62,23.49 114.62,24.13 | 114.62,22.22 114.62,23.49 | 114.62,22.22 114.62,19.68 | 114.62,19.68 114.62,19.05 | 115.25,19.68 117.16,19.68 | 114.62,19.68 115.25,19.68 | 115.25,19.68 115.25,20.95 115.89,21.59 116.52,21.59 117.16,20.95 | 114.62,23.49 117.16,23.49 117.79,22.86 118.43,23.49 118.43,24.13 117.79,24.76 | 114.62,22.22 117.16,22.22 | 114.62,22.22 113.98,22.22 113.35,21.59 113.35,20.32 113.98,19.68
N$53
  Top 0.254: 117.16,19.68 115.89,20.95 113.98,19.05 113.35,19.68 113.98,20.32 115.25,19.05
N$54
  Top 0.254: 114.62,21.59 114.62,20.95 | 114.62,22.86 114.62,21.59 | 114.62,22.86 114.62,25.4 | 114.62,25.4 114.62,26.04 | 115.25,25.4 117.16,25.4 | 114.62,25.4 115.25,25.4 | 115.25,25.4 115.25,24.13 115.89,23.49 116.52,23.49 117.16,24.13 | 114.62,21.59 117.16,21.59 117.79,22.22 118.43,21.59 118.43,20.95 117.79,20.32 | 114.62,22.86 117.16,22.86 | 114.62,22.86 113.98,22.86 113.35,23.49 113.35,24.76 113.98,25.4
N$55
  Top 0.254: C40.2 R50.1 87,19.05 IC10.12
N$56
  Top 0.254: D9.C 59.05,25.4 56.52,22.86 D8.C
N$57
  Top 0.254: IC10.15 R47.1 C38.2
N$58
  Top 1.016: IC1.5 102.23,53.34 100.33,51.44 100.33,48.9 101.6,47.62 C14.- 103.5,47.62 106.05,45.09 IC6.IN
N$59
  Top 1.016: D1.A SW.2
N$60
  Top 0.254: C32.1 R50.2 R49.2 R48.2
N$61
  Top 0.254: IC10.13 84.45,19.05 R49.1 C39.2
N$62
  Top 0.254: IC10.16 C38.1 R46.1
N$63
  Top 0.254: 12.07,58.42 12.07,57.79 13.34,56.52 15.24,56.52 15.88,55.88 IC2.7 | 12.07,58.42 12.07,59.69 C5.2 15.88,63.5 R6.1 | R5.2 12.07,58.42
N$64
  Top 0.254: R47.2 C31.1 R46.2 71.75,29.21 C27.-
N$65
  Top 0.254: C21.2 C21.3 84.45,36.83 76.2,36.83 73.66,34.29 60.33,34.29 R28.1 57.78,36.83 43.18,36.83 42.55,37.47 42.55,41.91 D2.A 45.09,44.45 53.98,44.45 | 53.98,44.45 IC4.1 | D7.C 55.24,44.45 53.98,44.45
N$66
  Top 0.254: R1.S 9.53,81.28 1.91,73.66 1.91,71.75 4.45,69.22 4.45,60.96 3.18,59.69 3.18,43.82 6.35,40.64 6.35,38.73 10.16,34.92 10.16,32.38 12.7,29.84 12.7,27.94 13.97,26.67 19.68,26.67 C26.+
N$68
  Top 0.254: R12.2 53.98,66.04 53.34,66.04 50.16,62.87 Q3.3
N$70
  Top 0.254: Q5.2 65.41,5.08 61.59,8.89 IC9.1
N$71
  Top 0.254: C48.1 R53.2
N$72
  Top 0.254: R22.1 C26.-
N$73
  Top 0.254: R56.1 R53.1 IC8.2
N$74
  Top 0.254: R38.2 37.47,30.48 32.38,30.48 31.11,29.21 C34.1 R51.1
N$75
  Top 0.254: R52.1 C44.1 32.38,19.05 32.38,22.86 34.93,25.4 45.09,25.4 R41.2
N$76  (via drill 0.6)
  Top 0.254: R56.2 32.38,5.08 32.38,6.98 31.75,7.62 26.67,7.62 23.5,10.79 R52.2 23.5,16.51 24.77,17.78 24.77,22.86 | 24.77,22.86 24.77,25.4 30.48,31.11 38.73,31.11 40.01,29.84 40.01,28.57 40.64,27.94 46.99,27.94 47.62,28.57 47.62,29.84 48.26,30.48 57.78,30.48 v59.05,29.21 | 24.77,22.86 C34.2 | v62.87,26.67 67.95,26.67 C37.+
  Bottom 0.254: v59.05,29.21 61.59,26.67 v62.87,26.67
N$77
  Top 0.254: R54.2 43.81,6.35 46.35,8.89 IC8.5 46.35,11.43 46.99,12.07 63.5,12.07 64.14,11.43 IC9.2
N$78
  Top 0.254: R54.1 50.16,5.08 50.16,3.81 | 50.16,3.81 50.16,3.17 51.44,1.91 66.67,1.91 67.31,1.91 Q5.3 | R57.1 50.16,3.81
N$80
  Top 0.254: J6.6 5.71,31.11 4.45,29.84 4.45,13.97 6.35,12.07 13.97,12.07 14.61,11.43 IC7.2
N$81
  Top 0.254: J6.4 5.71,26.04 5.08,25.4 5.08,14.61 6.99,12.7 15.88,12.7 17.14,11.43 IC7.3
N$82
  Top 0.254: J6.3 6.35,23.49 5.71,22.86 5.71,15.24 7.62,13.34 17.78,13.34 19.68,11.43 IC7.4
N$83
  Top 0.254: R55.2 C49.1
N$84
  Top 0.254: IC8.7 R55.1 R58.2
TIME_CV
  Top 0.254: IC7.6 17.14,19.05 17.78,19.68 20.32,19.68 21.59,18.41 21.59,7.62 27.3,1.91 41.91,1.91 48.89,8.89 IC8.6
VCA_OUT
  Top 0.254: R11.1 40.01,57.15 43.81,57.15 | C4.- 45.72,57.15 43.81,57.15 | 43.81,57.15 IC3.9
VCA_OUT_AC  (via drill 0.6)
  Top 0.254: R45.2 66.67,29.84 64.14,32.38 57.78,32.38 55.88,34.29 v50.16,34.29 | C4.+ 50.16,53.98 48.89,52.71 23.5,52.71 22.86,53.34 22.86,61.59 R7.2
  Bottom 0.254: C4.+ v50.16,34.29
VCC  (via drill 0.6)
  Top 0.61: 13.34,49.53 IC2.8 C13.1 | 13.34,49.53 20.32,49.53 22.23,51.44 v37.78,51.44 v60.33,51.44 87,51.44 | J5.2 10.79,46.99 13.34,49.53 | C11.1 87,55.88 IC5.11 87,51.44 | IC11.OUT C46.+ 103.5,16.51 106.05,19.05 C42.1 106.05,21.59 105.41,22.22 v99.69,22.22 | v96.52,51.44 87,51.44 | v96.52,48.26 97.16,47.62 v97.16,22.22 97.16,17.18 94.58,14.61 v73.66,14.61 v61.59,14.61 33.66,14.61 | C19.1 64.14,44.45 63.5,45.09 62.23,45.09 61.59,45.72 IC4.4 | 76.83,5.08 74.93,5.08 C50.1 | 76.83,5.08 C53.+ | 76.83,5.08 IC10.1 | IC9.8 C45.1 | v24.77,11.43 30.48,11.43 33.66,14.61 | v19.68,6.35 C47.1 IC7.1 | 33.66,14.61 C43.1 IC8.16
  Bottom 0.406: C6.1 38.73,55.88 IC3.11
  Bottom 0.61: IC4.4 61.59,48.9 60.33,50.16 v60.33,51.44 | v37.78,51.44 38.73,52.39 IC3.11 | v96.52,48.26 v96.52,51.44 | v97.16,22.22 v99.69,22.22 | v61.59,14.61 IC9.8 | v73.66,14.61 C50.1 | v19.68,6.35 v24.77,11.43
VCO_I
  Top 0.254: Q5.1 70.48,7.62 74.93,12.07 88.9,12.07 89.53,11.43 IC10.6
VEE  (via drill 0.6)
  Top 0.254: C8.2 62.87,59.69 62.87,62.23 61.59,63.5 R14.1 61.59,67.31 | R11.2 52.07,66.04 53.34,67.31 61.59,67.31 | 61.59,67.31 R4.1 | R30.1 65.41,36.83 65.41,50.16 | R58.1 60.33,2.54 66.04,2.54 67.31,3.81 68.58,3.81 69.22,4.45 69.22,5.71 68.58,6.35 67.31,6.35 65.41,8.26 65.41,13.34
  Top 0.406: R19.2 93.98,64.14 v93.98,52.71
  Top 0.61: 87,50.16 65.41,50.16 v62.87,50.16 v40.01,50.16 22.86,50.16 20.96,48.26 IC2.4 C17.2 | 87,50.16 v93.98,50.16 96.52,50.16 98.42,48.26 98.42,23.49 | 87,50.16 IC5.6 87,45.72 C22.2 | IC4.11 61.59,55.88 C8.2 | IC6.OUT C24.- 103.5,29.21 106.05,26.67 C33.2 106.05,24.13 105.41,23.49 98.42,23.49 | 98.42,23.49 98.42,16.51 95.25,13.34 69.22,13.34 | 69.22,13.34 65.41,13.34 v53.98,13.34 | C18.2 38.73,45.72 IC3.6 | 69.22,13.34 IC9.4 | IC8.9 C36.2
  Bottom 0.406: R36.2 92.08,40.64 C22.2 | v93.98,50.16 v93.98,52.71
  Bottom 0.61: IC4.11 61.59,52.71 62.87,51.44 v62.87,50.16 | v40.01,50.16 38.73,48.9 IC3.6 | v53.98,13.34 IC8.9

### Text on the board
tPlace: V/Oct | CV1> | CV2> | Q> | F> | VCA> | OSC> | GND | +5V | P_EN> | EN> | CLK> | SER> | GND | +5V
tNames: IN | OUT | NP | NP | NP | NP